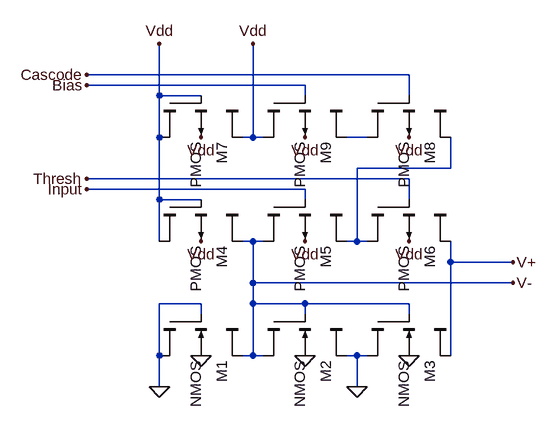
[diagram p0: schematic comparatorPreampLVS.asc]
comparatorPreampLVS.asc, the LTspice schematic file:
Version 4
SHEET 1 880 680
WIRE 416 -192 -80 -192
WIRE 256 -176 -80 -176
WIRE 32 -160 32 -240
WIRE 96 -160 32 -160
WIRE 256 -160 256 -176
WIRE 416 -160 416 -192
WIRE 32 -96 32 -160
WIRE 176 -96 176 -240
WIRE 176 -96 160 -96
WIRE 192 -96 176 -96
WIRE 352 -96 320 -96
WIRE 480 -48 480 -96
WIRE 480 -48 336 -48
WIRE 416 -32 -80 -32
WIRE 256 -16 -80 -16
WIRE 32 0 32 -96
WIRE 96 0 32 0
WIRE 256 0 256 -16
WIRE 416 0 416 -32
WIRE 32 64 32 0
WIRE 176 64 160 64
WIRE 192 64 176 64
WIRE 336 64 336 -48
WIRE 336 64 320 64
WIRE 352 64 336 64
WIRE 480 96 480 64
WIRE 576 96 480 96
WIRE 176 128 176 64
WIRE 576 128 176 128
WIRE 96 160 32 160
WIRE 176 160 176 128
WIRE 256 160 176 160
WIRE 416 160 256 160
WIRE 96 176 96 160
WIRE 256 176 256 160
WIRE 416 176 416 160
WIRE 32 240 32 160
WIRE 176 240 176 160
WIRE 176 240 160 240
WIRE 192 240 176 240
WIRE 336 240 320 240
WIRE 352 240 336 240
WIRE 480 240 480 96
WIRE 32 288 32 240
WIRE 336 288 336 240
FLAG 96 240 0
FLAG 256 240 0
FLAG 416 240 0
FLAG 336 288 0
FLAG 32 288 0
FLAG 96 64 Vdd
FLAG 256 64 Vdd
FLAG 416 64 Vdd
FLAG 96 -96 Vdd
FLAG 416 -96 Vdd
FLAG 256 -96 Vdd
FLAG 32 -240 Vdd
FLAG 176 -240 Vdd
FLAG -80 -16 Input
FLAG -80 -32 Thresh
FLAG -80 -192 Cascode
FLAG -80 -176 Bias
FLAG 576 96 V+
FLAG 576 128 V-
SYMBOL cktsym\\nmos4 96 240 R90
SYMATTR InstName M1
SYMATTR Value2 l=.9u w=1.5u
SYMBOL cktsym\\nmos4 256 240 R90
SYMATTR InstName M2
SYMATTR Value2 l=.9u w=1.5u
SYMBOL cktsym\\nmos4 416 240 R90
SYMATTR InstName M3
SYMATTR Value2 l=.9u w=1.5u
SYMBOL cktsym\\pmos4 96 64 R90
SYMATTR InstName M4
SYMATTR Value2 l=.9u w=1.5u
SYMBOL cktsym\\pmos4 256 64 R90
SYMATTR InstName M5
SYMATTR Value2 l=.9u w=1.5u
SYMBOL cktsym\\pmos4 416 64 R90
SYMATTR InstName M6
SYMATTR Value2 l=.9u w=1.5u
SYMBOL cktsym\\pmos4 96 -96 R90
SYMATTR InstName M7
SYMATTR Value2 l=.9u w=1.8u
SYMBOL cktsym\\pmos4 416 -96 R90
SYMATTR InstName M8
SYMATTR Value2 l=.9u w=1.8u
SYMBOL cktsym\\pmos4 256 -96 R90
SYMATTR InstName M9
SYMATTR Value2 l=3.9u w=8.1u

The netlist it stands for:
* comparatorPreampLVS.asc
M1 V- 0 0 0 NMOS l=.9u w=1.5u
M2 0 V- V- 0 NMOS l=.9u w=1.5u
M3 V+ V- 0 0 NMOS l=.9u w=1.5u
M4 Vdd Vdd V- Vdd PMOS l=.9u w=1.5u
M5 V- Input N002 Vdd PMOS l=.9u w=1.5u
M6 N002 Thresh V+ Vdd PMOS l=.9u w=1.5u
M7 Vdd Vdd Vdd Vdd PMOS l=.9u w=1.8u
M8 N001 Cascode N002 Vdd PMOS l=.9u w=1.8u
M9 Vdd Bias N001 Vdd PMOS l=3.9u w=8.1u
.model NMOS NMOS
.model PMOS PMOS
.lib standard.mos
.backanno
.end